# Altium project Kitojo_project.PrjPcb
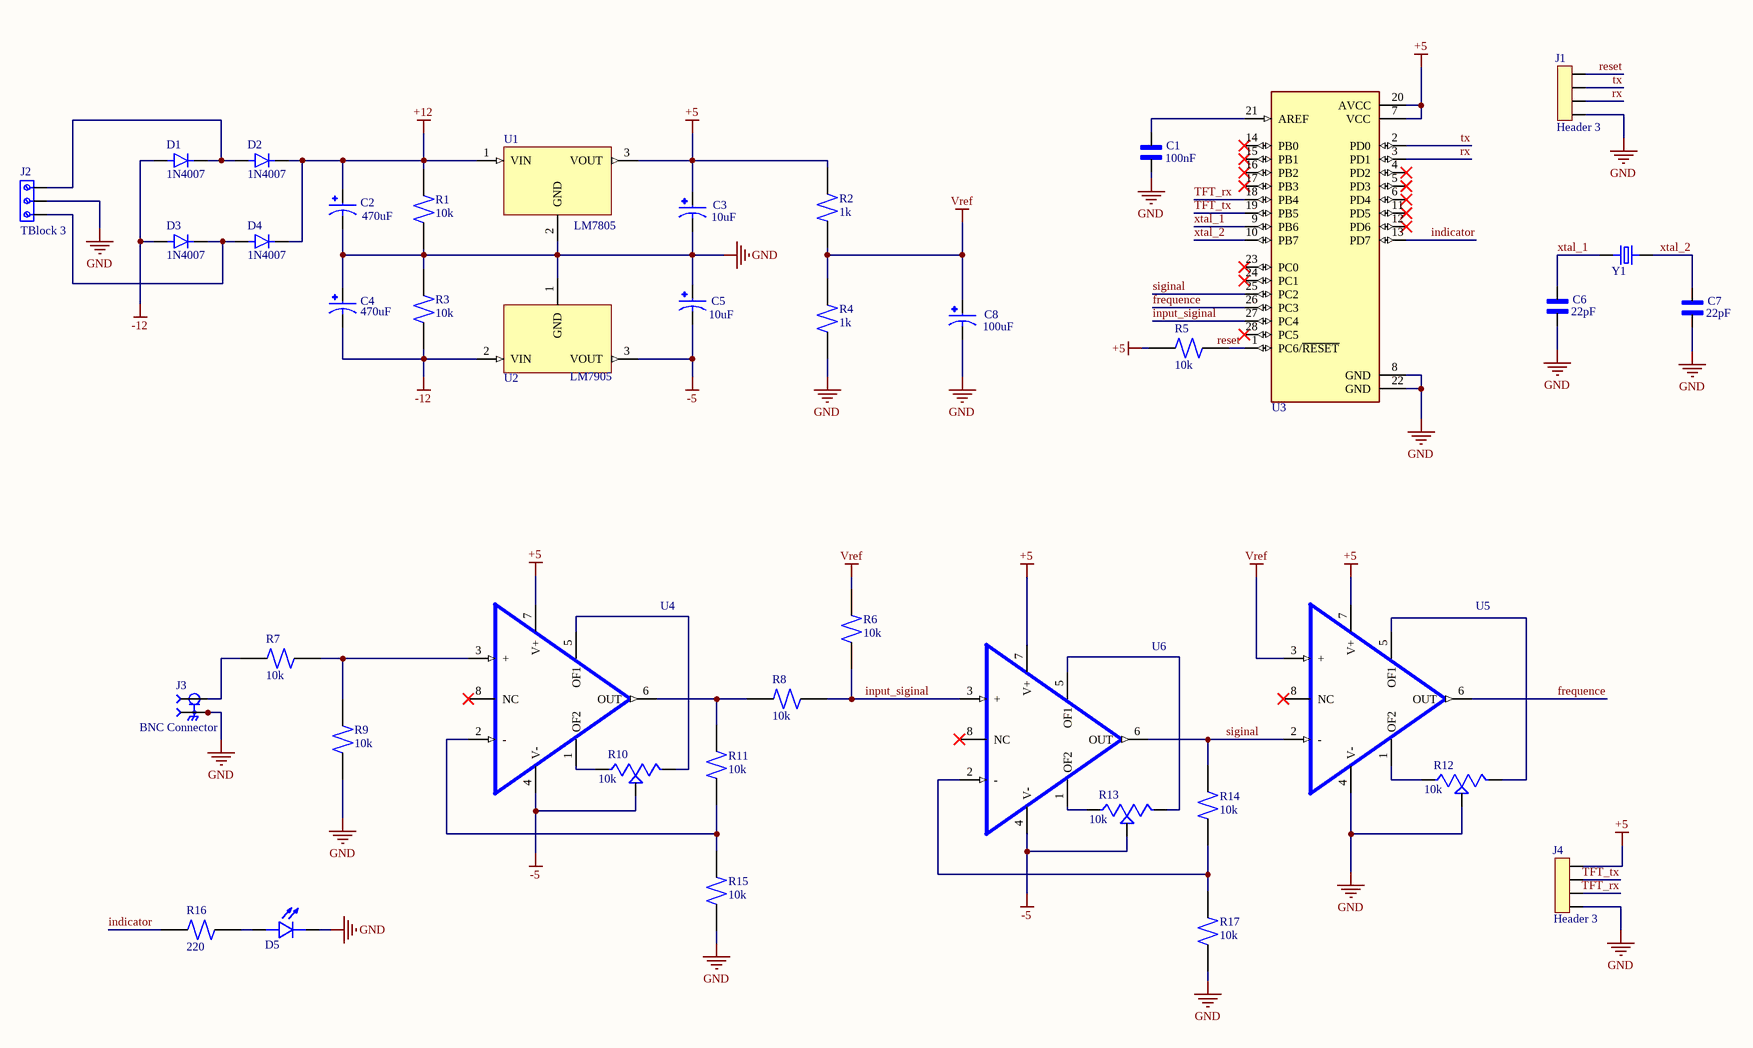
[diagram p0: schematic.SchDoc]
1 sheet, 41 parts. Net scope: global (net labels, ports and power ports of the same name join across sheets).
Board file: PCB_layout.PcbDoc

## Sheet schematic.SchDoc
size A3; SheetNumber: 1; SheetTotal: 1

### Parts
C1  100nF  [CAPRB500W50L450T300H550]
C2  470uF  [CAPPRD500W50D500H1100]
C3  10uF  [CAPPRD500W50D500H1100]
C4  470uF  [CAPPRD500W50D500H1100]
C5  10uF  [CAPPRD500W50D500H1100]
C6  22pF  [CAPRB500W50L450T300H550]
C7  22pF  [CAPRB500W50L450T300H550]
C8  100uF  [CAPPRD500W50D500H1100]
D1  1N4007  [DIOAD1060W80L520D270]
D2  1N4007  [DIOAD1060W80L520D270]
D3  1N4007  [DIOAD1060W80L520D270]
D4  1N4007  [DIOAD1060W80L520D270]
D5  L08R5000Q1  [LEDRD254W57D500H1070]  (value not drawn)
J1  Header 3  [SULLINS_PPTC041LFBN-RC]
J2  TBlock 3  [691214110003]
J3  BNC Connector  [MOLEX_0731711640]
J4  Header 3  [SULLINS_PPTC041LFBN-RC]
R1  10k  [RESAD1100W55L680D260]
R2  1k  [RESAD1100W55L680D260]
R3  10k  [RESAD1100W55L680D260]
R4  1k  [RESAD1100W55L680D260]
R5  10k  [RESAD1100W55L680D260]
R6  10k  [RESAD1100W55L680D260]
R7  10k  [RESAD1100W55L680D260]
R8  10k  [RESAD1100W55L680D260]
R9  10k  [RESAD1100W55L680D260]
R10  10k  [TRIM_3306F-1-105]
R11  10k  [RESAD1100W55L680D260]
R12  10k  [TRIM_3306F-1-105]
R13  10k  [TRIM_3306F-1-105]
R14  10k  [RESAD1100W55L680D260]
R15  10k  [RESAD1100W55L680D260]
R16  220  [RESAD1100W55L680D260]
R17  10k  [RESAD1100W55L680D260]
U1  LM7805  [TO255P1020X450X1968-3]
U2  LM7905  [TO255P1020X450X1968-3]
U3  ATMEGA328P-PU  [DIP794W46P254L2967H457Q28B]  (value not drawn)
U4  OP-Amp  [DIP254P762X508-8]  (value not drawn)
U5  OP-Amp  [DIP254P762X508-8]  (value not drawn)
U6  OP-Amp  [DIP254P762X508-8]  (value not drawn)
Y1  ECS-160-S-4  [XTAL_ECS-160-20-4X]  (value not drawn)

### Nets
+5: C3.P J4.1 R2.1 R5.1 U1.3(VOUT) U3.7(VCC) U3.20(AVCC) U4.7(V+) U5.7(V+) U6.7(V+)
+12: C2.P D2.C D4.C R1.1 U1.1(VIN)
-5: C5.N R10.2(WIPER) R13.2(WIPER) U2.3(VOUT) U4.4(V-) U6.4(V-)
-12: C4.N D1.A D3.A R3.2 U2.2(VIN)
GND: C1.2 C2.N C3.N C4.P C5.P C6.2 C7.2 C8.N D5.C J1.4 J2.2 J3.2 J3.3 J3.4 J3.5 J4.4 R1.2 R3.1 R4.2 R9.2 R12.2(WIPER) R15.1 R17.1 U1.2(GND) U2.1(GND) U3.8(GND) U3.22(GND) U5.4(V-)
Vref: C8.P R2.2 R4.1 R6.2 U5.3(+)
frequence: U3.26(PC3) U5.6(OUT)
indicator: R16.1 U3.13(PD7)
input_siginal: R6.1 R8.1 U3.27(PC4) U6.3(+)
reset: J1.1 R5.2 U3.1(PC6/~{RESET})
rx: J1.3 U3.3(PD1)
siginal: R14.2 U3.25(PC2) U5.2(-) U6.6(OUT)
TFT_rx: J4.3 U3.18(PB4)
TFT_tx: J4.2 U3.19(PB5)
tx: J1.2 U3.2(PD0)
xtal_1: C6.1 U3.9(PB6) Y1.1
xtal_2: C7.1 U3.10(PB7) Y1.2
NetC1_1: C1.1 U3.21(AREF)
NetD1_C: D1.C D2.A J2.3
NetD3_C: D3.C D4.A J2.1
NetD5_A: D5.A R16.2
NetJ3_1: J3.1 R7.2
NetR7_1: R7.1 R9.1 U4.3(+)
NetR8_2: R8.2 R11.2 U4.6(OUT)
NetR10_1: R10.1(CCW) U4.1(OF2)
NetR10_3: R10.3(CW) U4.5(OF1)
NetR11_1: R11.1 R15.2 U4.2(-)
NetR12_1: R12.1(CCW) U5.1(OF2)
NetR12_3: R12.3(CW) U5.5(OF1)
NetR13_1: R13.1(CCW) U6.1(OF2)
NetR13_3: R13.3(CW) U6.5(OF1)
NetR14_1: R14.1 R17.2 U6.2(-)

Not connected (* = marked no-connect by the designer): U3 4(PD2)* 5(PD3)* 6(PD4)* 11(PD5)* 12(PD6)* 14(PB0)* 15(PB1)* 16(PB2)* 17(PB3)* 23(PC0)* 24(PC1)* 28(PC5)*; U4 8(NC)*; U5 8(NC)*; U6 8(NC)*

### Library data of the parts
C1 C6 C7 = Ceramic capacitor: 2200 pF Â±10% 250V Ceramic Capacitor X7R Radial; MF: TDK; MP: FG24X7R2E222KNT06; Digi-Key_Part_Number: 445-173386-1-ND; Purchase-URL: https://pricing.snapeda.com/search/part/FG24X7R2E222KNT06/?ref=eda; Check_prices: https://www.snapeda.com/parts/FG24X7R2E222KNT06/TDK/view-part/?ref=eda; Value: *; Package: Radial TDK; SnapEDA_Link: https://www.snapeda.com/parts/FG24X7R2E222KNT06/TDK/view-part/?ref=snap
C2-C5 C8 = Electrolytic capacitor: FS-A; MF: {'manufacturer': u'Panasonic'}; MP: EEUFS0J221B; Package: None; Value: *; Availability: Unavailable; Price: None
D1-D4 = 1N4007: Diode Switching 1KV 1A 2-Pin DO-41; Price: None; MP: 1N4007; Value: *; Availability: Unavailable; Package: None
D5 = LED: LED, Orange, Through Hole, T-1 3/4 (5mm), 30 mA, 2.1 V, 635 nm; MF: {'manufacturer': u'LED Technology'}; Price: None; Package: None; Availability: Unavailable; MP: L08R5000Q1; Value: *
J1 J4 = Female header - 4Pins: 4 Position Header Connector Through Hole; MP: PPTC041LFBN-RC; MF: Sullins Connector; Value: *; SnapEDA_Link: https://www.snapeda.com/parts/PPTC041LFBN-RC/Sullins%20Connector%20Solutions/view-part/285917/?ref=snap; Package: None; Availability: Warning; Check_prices: https://www.snapeda.com/parts/PPTC041LFBN-RC/Sullins%20Connector%20Solutions/view-part/285917/?ref=eda; Price: None; Purchase-URL: https://pricing.snapeda.com/search/part/PPTC041LFBN-RC/?ref=eda
J2 = Terminal blocks - 3Pins (Small): 3 Position Wire to Board Terminal Block Horizontal with Board 0.138 (3.50mm) Through Hole; MF: Wurth Elektronik; Price: None; SnapEDA_Link: https://www.snapeda.com/parts/691214110003/Wurth+Elektronik/view-part/?ref=snap; Purchase-URL: https://pricing.snapeda.com/search/part/691214110003/?ref=eda; Availability: In Stock; MP: 691214110003; Package: None; Check_prices: https://www.snapeda.com/parts/691214110003/Wurth+Elektronik/view-part/?ref=eda; Value: *
J3 = BNC Connector: BNC Connector Jack, Female Socket 75Ohm Through Hole, Right Angle Solder; MF: Molex; MP: 0731711640; Purchase-URL: https://pricing.snapeda.com/search/part/0731711640/?ref=eda; Package: None; Value: *; Availability: Warning; Price: None; SnapEDA_Link: https://www.snapeda.com/parts/0731711640/Molex/view-part/3208873/?ref=snap; Check_prices: https://www.snapeda.com/parts/0731711640/Molex/view-part/3208873/?ref=eda
R1-R9 R11 R14-R17 = Resistor (0.25W): (MFR-25FBF52-10K) 10,2 kOhm bei 1% 0,25W, 1/4W Durchbohrlochwiderstand Axial Metal Film; MF: Yageo; Digi-Key_Part_Number: 10.2KXBK-ND; SnapEDA_Link: https://www.snapeda.com/parts/MFR-25FBF52-10K/Yageo/view-part/424333/?ref=snap; Package: Axial Yageo; Purchase-URL: https://pricing.snapeda.com/search/part/MFR-25FBF52-10K/?ref=eda; MP: MFR-25FBF52-10K; Value: *
R10 R12 R13 = Potentiometer1: (3306F-1-105) 1 MOhms 0.2W, 1/5W PC Pins Through Hole Trimmer Potentiometer Cermet 1 Turn Top Adjustment; MF: Bourns; Check_prices: https://www.snapeda.com/parts/3306F-1-105/Bourns%20-%20J.W.%20Miller/view-part/862876/?ref=eda; Availability: Good; Value: *; Price: None; MP: 3306F-1-105; SnapEDA_Link: https://www.snapeda.com/parts/3306F-1-105/Bourns%20-%20J.W.%20Miller/view-part/862876/?ref=snap; Package: 3306F Bourns; Purchase-URL: https://pricing.snapeda.com/search/part/3306F-1-105/?ref=eda
U1 = LM78__: MP: LM7805CT/NOPB; Price: None; Value: *; Availability: Unavailable; Package: None
U2 = LM79__
U3 = ATMEGA328P-PU: ATmega Series 20 MHz 32 KB Flash 2 KB SRAM 8-Bit Microcontroller - DIP-28; Value: *; MP: ATMEGA328P-PU; Package: None; Availability: Unavailable; Price: None
U4-U6 = LM741CN: General Purpose Amplifier 1 Circuit - 8-DIP; MF: ON Semiconductor; Price: None; Value: *; MP: LM741CN; Package: DIP-8 ON Semiconductor; SnapEDA_Link: https://www.snapeda.com/parts/LM741CN/Onsemi/view-part/?ref=snap; Check_prices: https://www.snapeda.com/parts/LM741CN/Onsemi/view-part/?ref=eda; Availability: In Stock
Y1 = Crystal oscilator: CRYSTAL T/H; MF: {'manufacturer': u'ECS Inc.'}; Package: None; Value: *; MP: ECS-160-S-4; Availability: Unavailable; Price: None